# EAGLE design xBeeController (EAGLE 7.2.0)
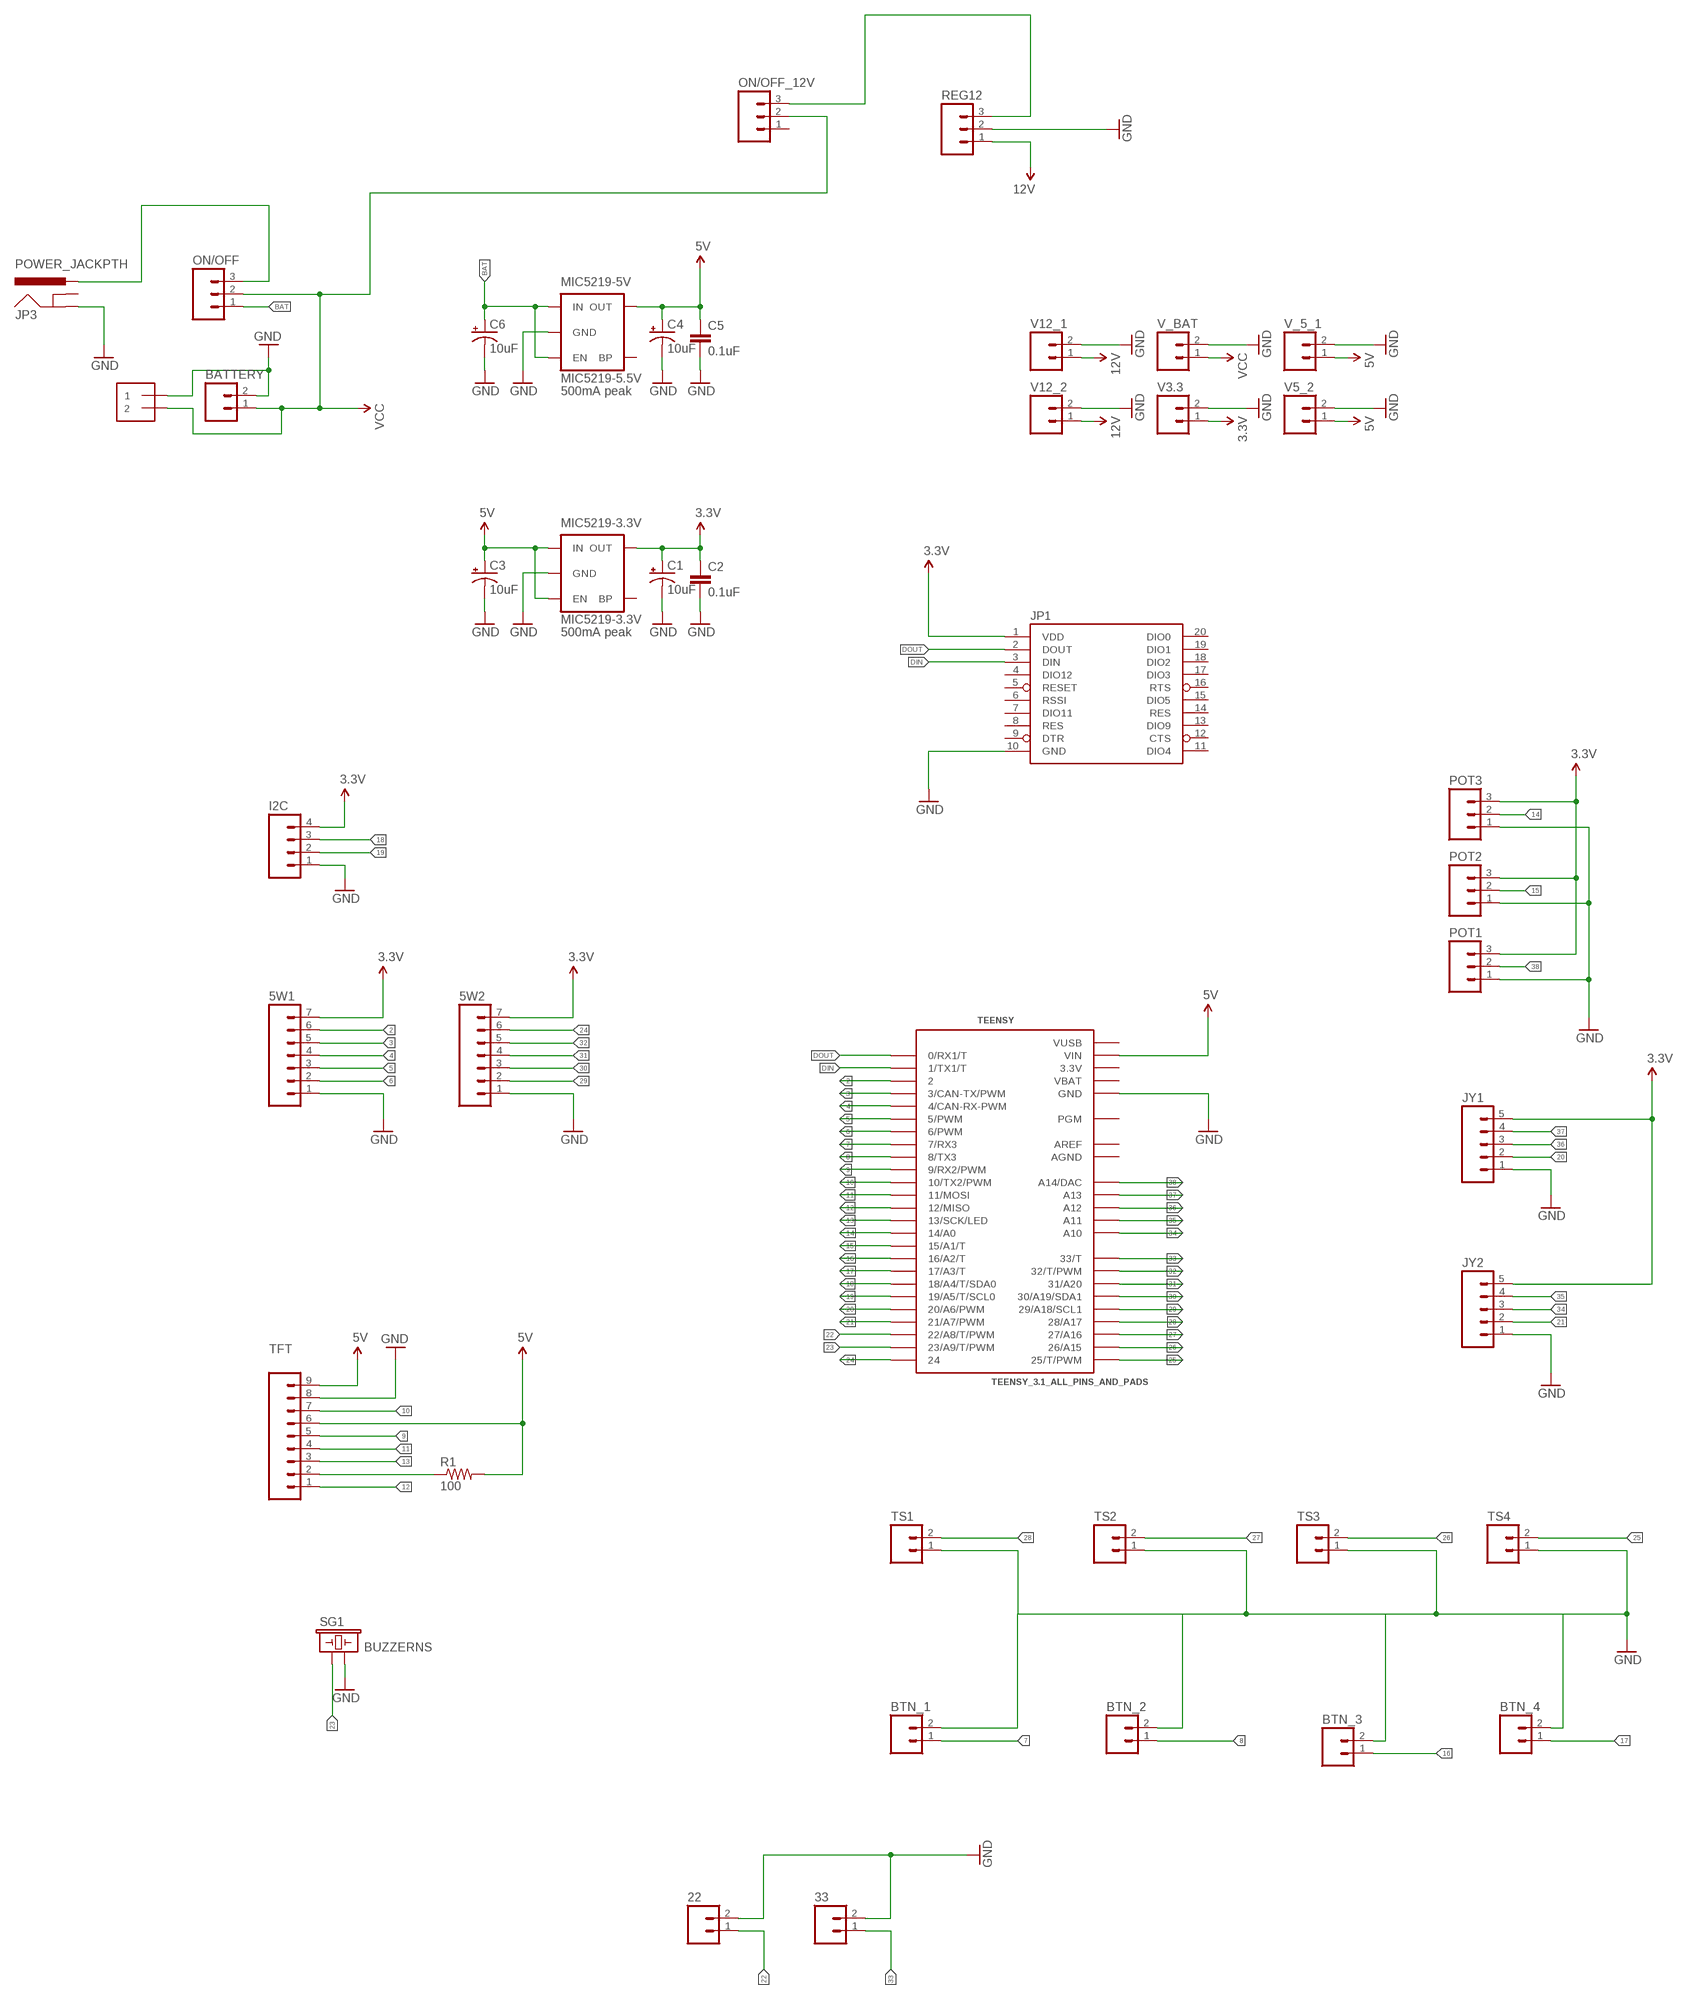
[diagram p0: schematic, sheet 1]

## Parts
5W1  M07  [1X07]
5W2  M07  [1X07]
22  M02PTH  [1X02]
33  M02PTH  [1X02]
BATTERY  M02PTH  [1X02]
BTN_1  M02PTH  [1X02]
BTN_2  M02PTH  [1X02]
BTN_3  M02PTH  [1X02]
BTN_4  M02PTH  [1X02]
C1  10uF  47UF-10V-10%(TANT)  [EIA3528]
C2  0.1uF  CAP0805  [0805]
C3  10uF  47UF-10V-10%(TANT)  [EIA3528]
C4  10uF  47UF-10V-10%(TANT)  [EIA3528]
C5  0.1uF  CAP0805  [0805]
C6  10uF  47UF-10V-10%(TANT)  [EIA3528]
I2C  M04PTH  [1X04]
J1  TERMBLOCK_1X2-3.5MM  [1X2-3.5MM]
JP1  XBEE-1B1  [XBEE-1]
JP3  POWER_JACKPTH  [POWER_JACK_PTH]
JY1  M05PTH  [1X05]
JY2  M05PTH  [1X05]
MIC5219-3.3V  V_REG_LDOSMD  [SOT23-5]
MIC5219-5V  V_REG_LDOSMD  [SOT23-5]
ON/OFF  M03PTH  [1X03]
ON/OFF_12V  M03PTH  [1X03]
POT1  M03PTH  [1X03]
POT2  M03PTH  [1X03]
POT3  M03PTH  [1X03]
R1  100  RESISTOR0805-RES  [0805]
REG12  M03PTH  [1X03]
SG1  BUZZERNS  [BUZZER-12MM-NS]
TEENSY  TEENSY_3.1_ALL_PINS_AND_PADS  [TEENSY_3.1_ALLPINS]
TFT  M09  [1X09]
TS1  M02PTH  [1X02]
TS2  M02PTH  [1X02]
TS3  M02PTH  [1X02]
TS4  M02PTH  [1X02]
V3.3  M02PTH  [1X02]
V5_2  M02PTH  [1X02]
V12_1  M02PTH  [1X02]
V12_2  M02PTH  [1X02]
V_5_1  M02PTH  [1X02]
V_BAT  M02PTH  [1X02]

## Nets
2: 5W1.6 TEENSY.2
3: 5W1.5 TEENSY.3(3/CAN-TX/PWM)
3.3V [vcc]: 5W1.7 5W2.7 C1.A(+) C2.1 I2C.4 JP1.1(VDD) JY1.5 JY2.5 MIC5219-3.3V.5(OUT) POT1.3 POT2.3 POT3.3 V3.3.1
4: 5W1.4 TEENSY.4(4/CAN-RX-PWM)
5: 5W1.3 TEENSY.5(5/PWM)
5V [vcc]: C3.A(+) C4.A(+) C5.1 MIC5219-3.3V.1(IN) MIC5219-3.3V.3(EN) MIC5219-5V.5(OUT) R1.2 TEENSY.VIN TFT.6 TFT.9 V5_2.1 V_5_1.1
6: 5W1.2 TEENSY.6(6/PWM)
7: BTN_1.1 TEENSY.7(7/RX3)
8: BTN_2.1 TEENSY.8(8/TX3)
9: TEENSY.9(9/RX2/PWM) TFT.5
10: TEENSY.10(10/TX2/PWM) TFT.7
11: TEENSY.11(11/MOSI) TFT.4
12: TEENSY.12(12/MISO) TFT.1
12V: REG12.1 V12_1.1 V12_2.1
13: TEENSY.13(13/SCK/LED) TFT.3
14: POT3.2 TEENSY.14/A0
15: POT2.2 TEENSY.15/A1(15/A1/T)
16: BTN_3.1 TEENSY.16/A2(16/A2/T)
17: BTN_4.1 TEENSY.17/A3(17/A3/T)
18: I2C.3 TEENSY.18/A4(18/A4/T/SDA0)
19: I2C.2 TEENSY.19/A5(19/A5/T/SCL0)
20: JY1.2 TEENSY.20/A6(20/A6/PWM)
21: JY2.2 TEENSY.21/A7(21/A7/PWM)
22: 22.1 TEENSY.22/A8(22/A8/T/PWM)
23: SG1.+ TEENSY.23/A9(23/A9/T/PWM)
24: 5W2.6 TEENSY.24
25: TEENSY.25(25/T/PWM) TS4.2
26: TEENSY.26(26/A15) TS3.2
27: TEENSY.27(27/A16) TS2.2
28: TEENSY.28(28/A17) TS1.2
29: 5W2.2 TEENSY.29(29/A18/SCL1)
30: 5W2.3 TEENSY.30(30/A19/SDA1)
31: 5W2.4 TEENSY.31(31/A20)
32: 5W2.5 TEENSY.32(32/T/PWM)
33: 33.1 TEENSY.33(33/T)
34: JY2.3 TEENSY.A10
35: JY2.4 TEENSY.A11
36: JY1.3 TEENSY.A12
37: JY1.4 TEENSY.A13
38: POT1.2 TEENSY.A14(A14/DAC)
BAT: C6.A(+) MIC5219-5V.1(IN) MIC5219-5V.3(EN) ON/OFF.1
DIN: JP1.3(DIN) TEENSY.1(1/TX1/T)
DOUT: JP1.2(DOUT) TEENSY.0(0/RX1/T)
GND [vcc]: 5W1.1 5W2.1 22.2 33.2 BATTERY.2 BTN_1.2 BTN_2.2 BTN_3.2 BTN_4.2 C1.C(-) C2.2 C3.C(-) C4.C(-) C5.2 C6.C(-) I2C.1 J1.1 JP1.10(GND) JP3.GND JY1.1 JY2.1 MIC5219-3.3V.2(GND) MIC5219-5V.2(GND) POT1.1 POT2.1 POT3.1 REG12.2 SG1.- TEENSY.GND TEENSY.GND1(GND) TEENSY.GND2(GND) TFT.8 TS1.1 TS2.1 TS3.1 TS4.1 V3.3.2 V5_2.2 V12_1.2 V12_2.2 V_5_1.2 V_BAT.2
N$1: R1.1 TFT.2
N$2: JP3.PWR ON/OFF.3
N$3: ON/OFF_12V.3 REG12.3
VCC: BATTERY.1 J1.2 ON/OFF.2 ON/OFF_12V.2 V_BAT.1
Unconnected: JP1.4(DIO12) JP1.5(RESET) JP1.6(RSSI) JP1.7(DIO11) JP1.8(RES) JP1.9(DTR) JP1.11(DIO4) JP1.12(CTS) JP1.13(DIO9) JP1.14(RES) JP1.15(DIO5) JP1.16(RTS) JP1.17(DIO3) JP1.18(DIO2) JP1.19(DIO1) JP1.20(DIO0) JP3.GNDBREAK MIC5219-3.3V.4(BP) MIC5219-5V.4(BP) ON/OFF_12V.1 TEENSY.PGM

## Notes on the sheet
- MIC5219-5.5V
- 500mA peak
- MIC5219-3.3V
- 500mA peak

## Power pins joined to a net without a drawn wire
3.3V: TEENSY.3.3V TEENSY.3.3V1(3.3V) TEENSY.3.3V2(3.3V)
AGND: TEENSY.AGND
AREF: TEENSY.AREF
VBAT: TEENSY.VBAT
VUSB: TEENSY.VUSB

## Library data of the parts
5W1 5W2 = SparkFun-Connectors:M07: Header 7 Standard 7-pin 0.1" header. Use with straight break away headers (SKU : PRT-00116), right angle break away headers (PRT-00553), swiss pins (PRT-00743), machine pins (PRT-00117), and female headers (PRT-00115). NOTES ON THE VARIANTS LOCK and LOCK_LONGPADS... This footprint was designed to help hold the alignment of a through-hole component (i.e. 7-pin header) while soldering it into place. You may notice that each hole has been shifted either up or down by 0.005 of an inch from it's more standard position (which is usually a perfectly straight line). This slight alteration caused the pins (the squares in the middle) to touch the edges of the holes. Because they are alternating, it causes a "brace" to hold the header in place. 0.005 has proven to be the perfect amount of "off-center" position when using our standard breakaway headers. Although looks a little odd when you look at the bare footprint, once you have a header in there, the alteration is very hard to notice. Also, if you push a header all the way into place, it is covered up entirely on the bottom side. This idea of altering the position of holes to aid alignment will be further integrated into the Sparkfun Library for other footprints. It can help hold any component with 3 or more connection pins.
22 33 BATTERY BTN_1-BTN_4 TS1-TS4 V3.3 V5_2 V12_1 V12_2 V_5_1 V_BAT = SparkFun-Connectors:M02: Standard 2-pin 0.1" header. Use with - straight break away headers ( PRT-00116) - right angle break away headers (PRT-00553) - swiss pins (PRT-00743) - machine pins (PRT-00117) - female headers (PRT-00115) Molex polarized connector foot print use with: PRT-08233 with associated crimp pins and housings. 2.54_SCREWTERM for use with PRT-10571. 3.5mm Screw Terminal footprints for PRT-08084 5mm Screw Terminal footprints for use with PRT-08432
C1 C3 C4 C6 = SparkFun-Capacitors:47UF-10V-10%(TANT): CAP-08310 47uF Tantalum SMT 10V 10% (EIA-3528); PROD_ID: CAP-08310; VALUE: 47uF
C2 C5 = SparkFun-Passives:CAP: Capacitor Standard 0603 ceramic capacitor, and 0.1" leaded capacitor.
I2C = SparkFun-Connectors:M04: Header 4 Standard 4-pin 0.1" header. Use with straight break away headers (SKU : PRT-00116), right angle break away headers (PRT-00553), swiss pins (PRT-00743), machine pins (PRT-00117), and female headers (PRT-00115). Molex polarized connector foot print use with SKU : PRT-08231 with associated crimp pins and housings. 1MM SMD Version SKU: PRT-10208
J1 = microbuilder:TERMBLOCK_1X2: 3.5mm Terminal block http://www.ladyada.net/library/pcb/eaglelibrary.html
JP1 = SparkFun-RF:XBEE-1: Xbee module footprints
JP3 = SparkFun-Connectors:POWER_JACK: Power Jack This is the standard 5.5mm barrel jack for power. The PTH is the most common, proven, reliable, footprint. The Slot footprint only works if the mill layer is transmitted to the PCB fab house so be warned. Mating wall wart : TOL-00298 (and others); PROD_ID: CONN-08197
JY1 JY2 = SparkFun-Connectors:M05: Header 5 Standard 5-pin 0.1" header. Use with straight break away headers (SKU : PRT-00116), right angle break away headers (PRT-00553), swiss pins (PRT-00743), machine pins (PRT-00117), and female headers (PRT-00115). Molex polarized connector foot print use with SKU : PRT-08230 with associated crimp pins and housings.
MIC5219-3.3V MIC5219-5V = SparkFun:V_REG_LDO: Voltage Regulator LDO Standard 150mA LDO voltage regulator in SOT-23 layout. Micrel part MIC5205. BP (by-pass) pin is used to lower output noise with 470pF cap.
ON/OFF ON/OFF_12V POT1-POT3 REG12 = SparkFun-Connectors:M03: Header 3 Standard 3-pin 0.1" header. Use with straight break away headers (SKU : PRT-00116), right angle break away headers (PRT-00553), swiss pins (PRT-00743), machine pins (PRT-00117), and female headers (PRT-00115). Molex polarized connector foot print use with SKU : PRT-08232 with associated crimp pins and housings.
R1 = SparkFun-Resistors:RESISTOR: Resistor Basic schematic elements and footprints for 0603, 1206, and PTH resistors.
SG1 = SparkFun-Electromechanical:BUZZER: Buzzer 12mm Spark Fun Electronics SKU : Comp-Buzzer
TEENSY = Teensy_3_Series_Board_v1.0:TEENSY_3.1_ALL_PINS_AND_PADS: Footprint for Teensy 3.1 board using all pads and all through-holes. Pads need a 2x7 0.1" SMD header.
TFT = SparkFun-Connectors:M09: Header 9 Standard 9-pin 0.1" header. Use with straight break away headers (SKU : PRT-00116), right angle break away headers (PRT-00553), swiss pins (PRT-00743), machine pins (PRT-00117), and female headers (PRT-00115).

## Net classes
1 vcc: width 0.305 mm

## Board
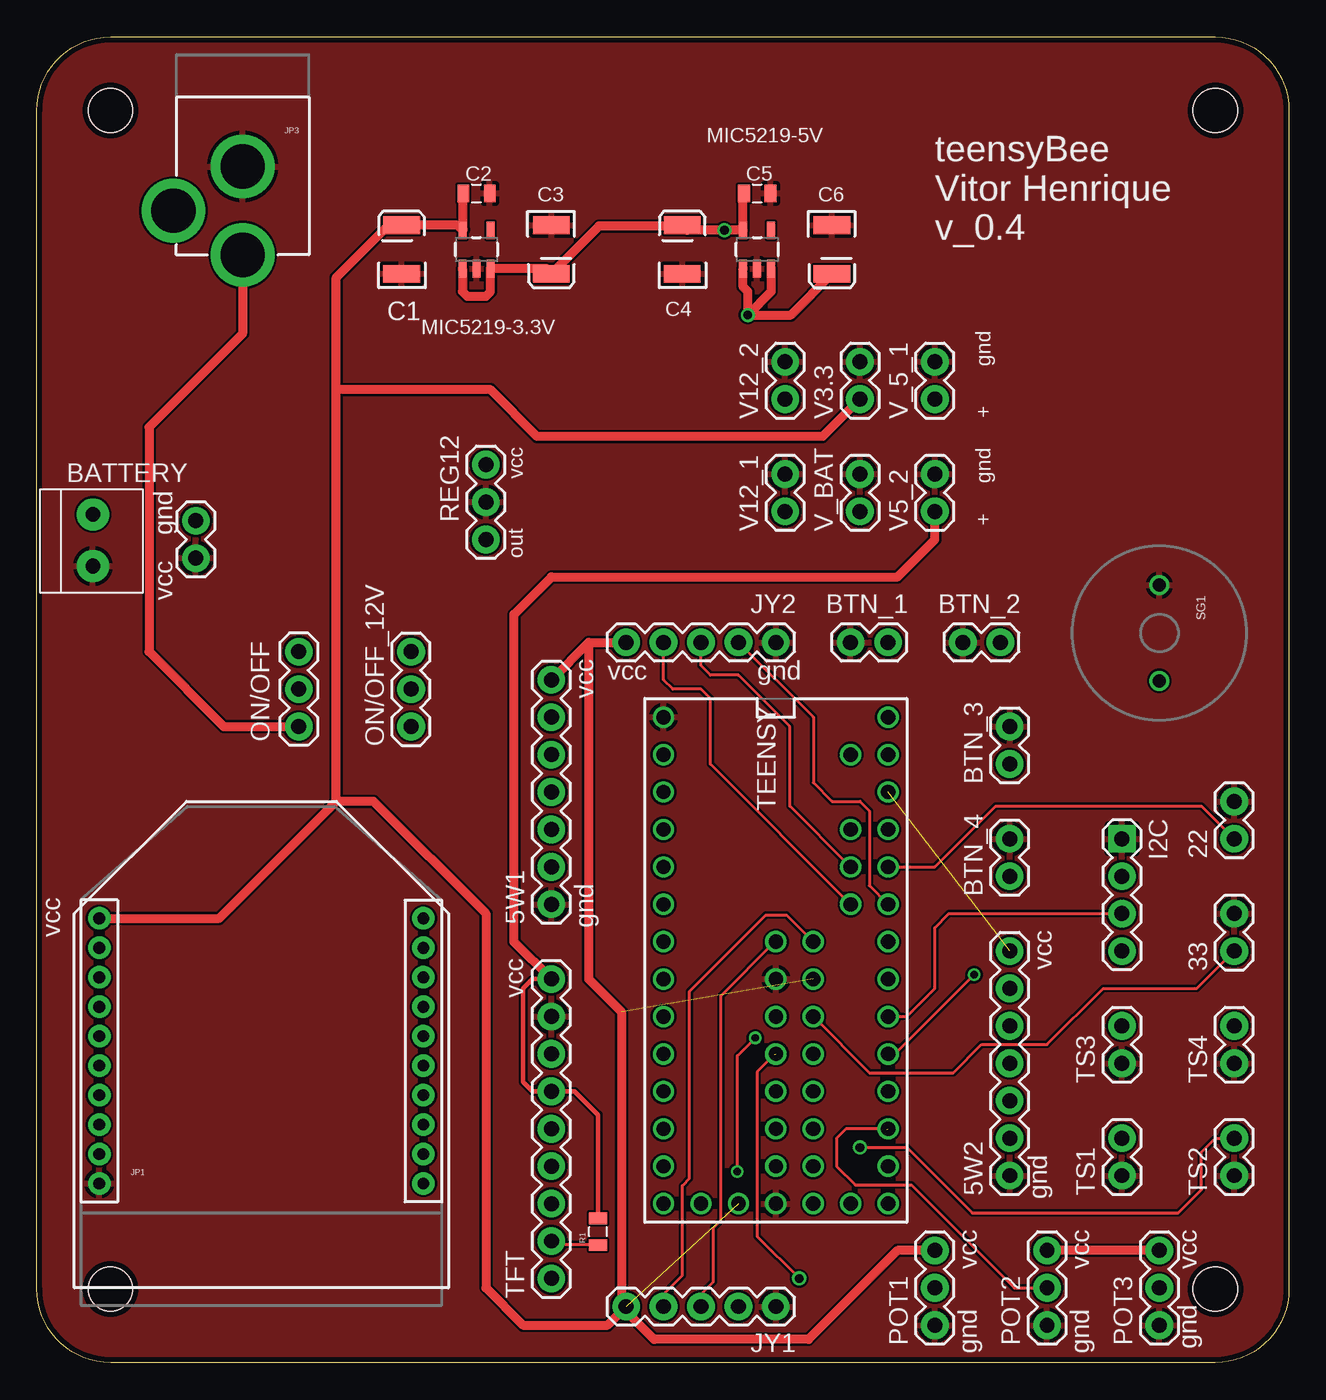
[diagram p1: board, top side]
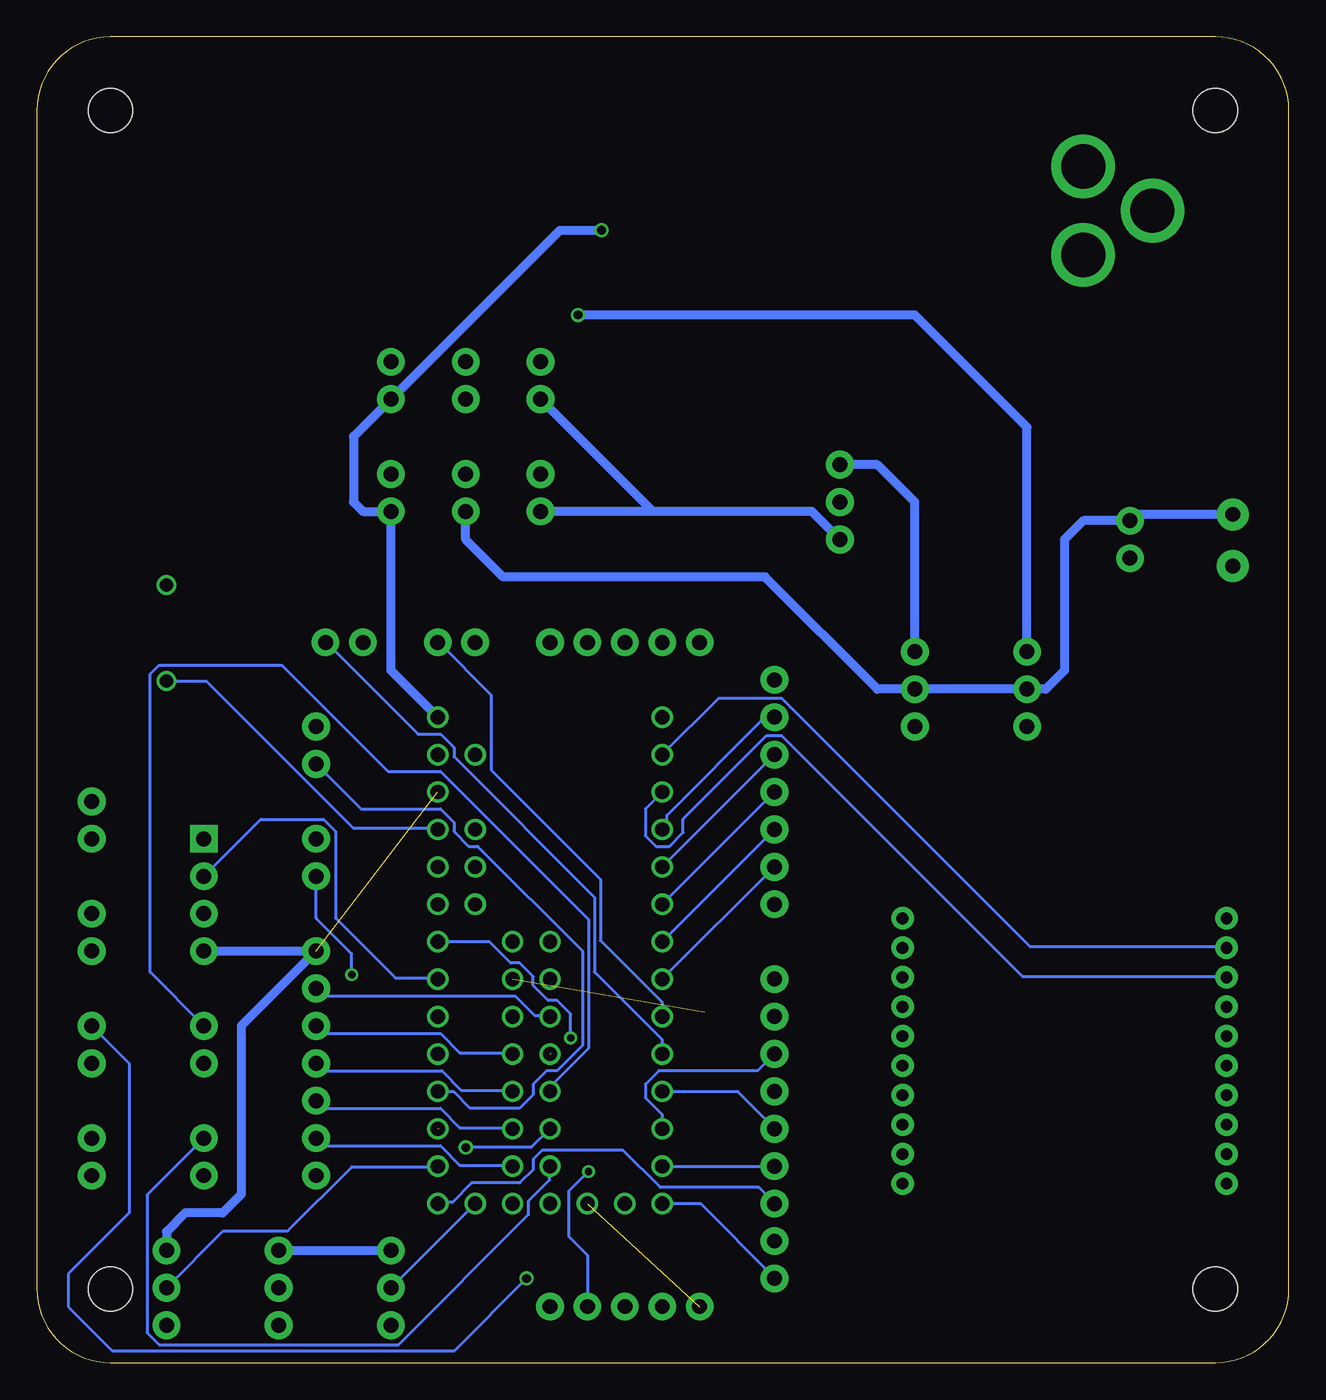
[diagram p2: board, bottom side, seen from below]

Size 85 x 90 mm. Coordinates in mm from the lower left corner, seen from the top.
Outline: 5,0 arc-90 0,5 0,85 arc-90 5,90 80,90 arc-90 85,85 85,5 arc-90 80,0 5,0
Copper layers (1*16): Top 0.0356mm / dielectric 1.5011mm / Bottom 0.0356mm
Design rules "LaenPCBOrder": minimum track width 6mil, minimum drill 13mil, track to track 6mil, track to pad 6mil, pad to pad 6mil, via to via 6mil, smd to smd 6mil, copper to edge 15mil, drill to drill 6mil, minimum pad ring 7mil, minimum via ring 7mil, stop-mask expansion 3mil, vias tented up to drill 0mil, thermal gap 10mil
Holes 3 mm at 5,5 5,85 80,85 80,5

### Footprints (pad centres in the part's own frame; a part is rotated, then mirrored left to right if it is on the bottom)
1X07 = drill 1.016 pad 1.88: 1 0,0; 2 2.54,0; 3 5.08,0; 4 7.62,0; 5 10.16,0; 6 12.7,0; 7 15.24,0
1X02 = drill 1.016 pad 1.88: 1 0,0; 2 2.54,0
EIA3528 = smd 1.2 x 2.5: A 1.65,0; C -1.65,0
0805 = smd 0.8 x 1.2: 1 -0.9,0; 2 0.9,0
1X04 = drill 1.016 pad 1.88 square: 1 0,0 | drill 1.016 pad 1.88: 2 2.54,0; 3 5.08,0; 4 7.62,0
1X2-3.5MM = drill 1 pad 2.184: 1 1.8,0; 2 -1.7,0
XBEE-1 = drill 0.8 pad 1.524: 1 -11,20; 2 -11,18; 3 -11,16; 4 -11,14; 5 -11,12; 6 -11,10; 7 -11,8; 8 -11,6; 9 -11,4; 10 -11,2; 11 11,2; 12 11,4; 13 11,6; 14 11,8; 15 11,10; 16 11,12; 17 11,14; 18 11,16; 19 11,18; 20 11,20
POWER_JACK_PTH = drill 2.997 pad 4.318: GND 0,7.7; GNDBREAK 4.7,10.7; PWR 0,13.7
1X05 = drill 1.016 pad 1.88: 1 0,0; 2 2.54,0; 3 5.08,0; 4 7.62,0; 5 10.16,0
SOT23-5 = smd 0.55 x 1.2: 1 -0.95,-1.3; 2 0,-1.3; 3 0.95,-1.3; 4 0.95,1.3; 5 -0.95,1.3
1X03 = drill 1.016 pad 1.88: 1 0,0; 2 2.54,0; 3 5.08,0
BUZZER-12MM-NS = drill 0.9: + 3.25,0; - -3.25,0
TEENSY_3.1_ALLPINS = drill 0.965: 0 -7.62,15.24; 1 -7.62,12.7; 2 -7.62,10.16; 3 -7.62,7.62; 3.3V 7.62,12.7; 3.3V1 -2.54,-15.24; 3.3V2 2.54,0; 4 -7.62,5.08; 5 -7.62,2.54; 6 -7.62,0; 7 -7.62,-2.54; 8 -7.62,-5.08; 9 -7.62,-7.62; 10 -7.62,-10.16; 11 -7.62,-12.7; 12 -7.62,-15.24; 13 7.62,-15.24; 14/A0 7.62,-12.7; 15/A1 7.62,-10.16; 16/A2 7.62,-7.62; 17/A3 7.62,-5.08; 18/A4 7.62,-2.54; 19/A5 7.62,0; 20/A6 7.62,2.54; 21/A7 7.62,5.08; 22/A8 7.62,7.62; 23/A9 7.62,10.16; 24 0,-2.54; 25 0,-5.08; 26 0,-7.62; 27 0,-10.16; 28 0,-12.7; 29 2.54,-12.7; 30 2.54,-10.16; 31 2.54,-7.62; 32 2.54,-5.08; 33 2.54,-2.54; A10 5.08,7.62; A11 5.08,5.08; A12 0,2.54; A13 2.54,2.54; A14 5.08,-15.24; AGND 7.62,15.24; AREF 5.08,10.16; GND -7.62,17.78; GND1 0,-15.24; GND2 0,0; PGM 2.54,-15.24; VBAT -5.08,-15.24; VIN 7.62,17.78; VUSB 5.08,15.24
1X09 = drill 1.016 pad 1.88: 1 0,0; 2 2.54,0; 3 5.08,0; 4 7.62,0; 5 10.16,0; 6 12.7,0; 7 15.24,0; 8 17.78,0; 9 20.32,0

### Placement (x,y rotation side)
5W1  34.92,31.11 90 top
5W2  66.04,12.7 90 top
22  81.28,35.56 90 top
33  81.28,27.94 90 top
BATTERY  10.79,57.15 270 top
BTN_1  57.78,48.9 180 top
BTN_2  65.41,48.9 180 top
BTN_3  66.04,40.64 90 top
BTN_4  66.04,33.02 90 top
C1  24.77,75.56 90 top
C2  29.84,79.38 0 top
C3  34.92,75.56 270 top
C4  43.81,75.56 90 top
C5  48.9,79.38 0 top
C6  53.98,75.56 270 top
I2C  73.66,35.56 270 top
J1  3.81,55.88 270 top
JP1  15.24,10.16 0 top
JP3  13.97,88.9 180 top
JY1  50.16,3.81 180 top
JY2  50.16,48.9 180 top
MIC5219-3.3V  29.84,75.56 0 top
MIC5219-5V  48.9,75.56 0 top
ON/OFF  17.78,48.26 270 top
ON/OFF_12V  25.4,43.18 90 top
POT1  60.96,2.54 90 top
POT2  68.58,2.54 90 top
POT3  76.2,2.54 90 top
R1  38.1,8.89 90 top
REG12  30.48,55.88 90 top
SG1  76.2,49.53 270 top
TEENSY  50.16,26.04 0 top
TFT  34.92,5.71 90 top
TS1  73.66,12.7 90 top
TS2  81.28,12.7 90 top
TS3  73.66,20.32 90 top
TS4  81.28,20.32 90 top
V3.3  55.88,65.41 90 top
V5_2  60.96,57.78 90 top
V12_1  50.8,57.78 90 top
V12_2  50.8,65.41 90 top
V_5_1  60.96,65.41 90 top
V_BAT  55.88,57.78 90 top

### Tracks (layer width: path | path; a pad name or v marks a point on that pad's centre or on a via)
2
  Bottom 0.203: TEENSY.2 42.23,36.51 42.23,37.15 35.56,43.81 5W1.6
3
  Bottom 0.203: 5W1.5 TEENSY.3
3.3V  (3 unrouted)
  Top 0.305: 28.96,76.91 MIC5219-3.3V.5 | 28.96,79.35 C2.1
  Top 0.61: 28.96,76.91 28.95,76.92 C2.1 | MIC5219-3.3V.5 28.55,77.22 C1.A 23.88,77.22 20.32,73.66 20.32,66.04 | JP1.1 12.38,30.16 20.32,38.1 | 20.32,38.1 20.32,66.04 | V3.3.1 53.34,62.87 33.97,62.87 30.8,66.04 20.32,66.04 | 20.32,38.1 22.86,38.1 30.48,30.48 30.48,5.08 33.02,2.54 38.73,2.54 JY1.5 | 5W1.7 37.47,48.9 | 37.47,48.9 JY2.5 | POT3.3 POT2.3 | POT1.3 58.42,7.62 52.39,1.59 41.91,1.59 40.01,3.49 JY1.5 | 37.47,48.9 37.47,26.04 39.69,23.81 39.69,4.13 JY1.5
  Bottom 0.61: POT2.3 POT1.3 | POT3.3 76.2,8.89 74.93,10.16 72.39,10.16 71.12,11.43 71.12,22.86 5W2.7 I2C.4
4
  Bottom 0.203: 5W1.4 TEENSY.4
5
  Bottom 0.203: 5W1.3 TEENSY.5
5V  (via drill 0.6)
  Top 0.305: TFT.9 33.66,26.04 33.02,25.4 33.02,19.05 33.66,18.41 TFT.6 36.51,18.41 38.1,16.83 R1.2
  Top 0.61: C5.1 47.95,79.33 MIC5219-5V.5 v46.67,76.86 44.16,76.86 C4.A 43.75,77.15 38.16,77.15 C3.A 34.58,74.27 MIC5219-3.3V.3 30.8,72.7 30.48,72.39 29.21,72.39 28.89,72.71 MIC5219-3.3V.1 | V5_2.1 60.96,55.88 58.42,53.34 34.92,53.34 32.38,50.8 32.38,28.57 TFT.9
  Bottom 0.61: v46.67,76.86 49.5,76.86 V_5_1.1 63.5,62.87 63.5,58.42 62.87,57.78 V5_2.1 60.96,46.99 TEENSY.VIN
6
  Bottom 0.203: 5W1.2 TEENSY.6
7
  Bottom 0.203: TEENSY.7 42.57,23.57 42.57,24.49 46.74,28.65 46.74,32.82 54.15,40.23 54.15,45.31 57.71,48.87 BTN_1.1
8
  Bottom 0.203: TEENSY.8 42.57,21.03 42.57,21.95 47.14,26.52 47.14,31.6 56.69,41.15 56.69,41.76 57.61,42.67 59.13,42.67 65.33,48.87 BTN_2.1
9
  Bottom 0.203: TEENSY.9 42.47,18.39 37.39,18.39 34.95,15.95 TFT.5
10
  Bottom 0.203: TFT.7 36.07,19.81 42.77,19.81 43.69,18.9 43.69,17.98 42.57,16.87 42.57,15.95 TEENSY.10
11
  Bottom 0.203: TEENSY.11 42.47,13.31 34.95,13.31 TFT.4
12
  Bottom 0.203: TEENSY.12 42.47,10.77 39.93,10.77 34.95,5.79 TFT.1
12V
  Bottom 0.61: 43.18,57.78 V12_1.1 | V12_2.1 43.18,57.78 | REG12.1 32.38,57.78 43.18,57.78
13
  Bottom 0.203: TEENSY.13 57.71,10.87 56.79,10.87 55.47,12.19 52.22,12.19 51.31,13.11 51.31,13.82 50.7,14.43 45.21,14.43 42.67,11.89 35.97,11.89 34.95,10.87 TFT.3
14
  Bottom 0.203: POT3.2 72.34,8.94 67.97,8.94 63.6,13.31 57.81,13.31 TEENSY.14/A0
15  (1 unrouted)
  Top 0.203: 57.71,15.85 57.68,15.88 54.93,15.88 54.29,15.24 54.29,13.34 55.56,12.06 59.37,12.06 66.36,5.08 POT2.2
16
  Bottom 0.203: BTN_3.1 62.99,37.59 57.61,37.59 56.69,36.68 56.69,36.07 55.68,35.05 55.07,35.05 47.95,27.94 47.95,21.54 49.68,19.81 50.39,19.81 51.31,18.9 51.31,18.19 52.22,17.27 55.58,17.27 56.69,18.39 57.71,18.39 TEENSY.16/A2
17  (via drill 0.51)
  Top 0.203: v63.63,26.34 58.32,21.03 57.81,21.03 TEENSY.17/A3
  Bottom 0.203: v63.63,26.34 63.63,27.75 66.04,30.16 BTN_4.1
18
  Top 0.203: TEENSY.18/A4 59.05,23.5 60.96,25.4 60.96,29.53 61.91,30.48 I2C.3
19
  Bottom 0.203: I2C.2 69.8,36.88 65.53,36.88 64.72,36.07 64.72,30.18 60.66,26.11 57.81,26.11 TEENSY.19/A5
20  (via drill 0.51)
  Top 0.203: v48.77,22.05 47.55,20.83 v47.55,12.98
  Bottom 0.203: v48.77,22.05 48.77,23.67 49.68,24.59 50.29,24.59 51.31,25.6 51.31,26.21 52.22,27.13 52.83,27.13 54.25,28.55 57.71,28.55 TEENSY.20/A6 | 47.65,3.86 JY1.2 47.62,7.3 48.9,8.57 48.9,11.63 v47.55,12.98
21
  Top 0.203: JY2.2 52.7,43.81 52.7,39.37 53.98,38.1 55.88,38.1 56.52,37.47 56.52,32.38 TEENSY.21/A7
22
  Top 0.203: TEENSY.22/A8 60.96,33.66 65.09,37.78 79.06,37.78 22.1
23
  Bottom 0.203: SG1.+ 76.2,46.23 73.46,46.23 63.5,36.27 57.81,36.27 TEENSY.23/A9
24
  Bottom 0.203: 5W2.6 65.53,24.89 52.53,24.89 51.21,23.57 50.19,23.57 TEENSY.24
25  (via drill 0.6)  (1 unrouted)
  Top 0.203: 50.09,20.93 48.9,19.74 48.9,8.57 v51.75,5.71
  Bottom 0.203: v51.75,5.71 56.66,0.81 79.87,0.81 82.87,3.81 82.87,6.03 78.74,10.16 78.74,20.32 TS4.2
26
  Bottom 0.203: TS3.2 77.32,26.52 77.32,46.74 76.71,47.35 68.38,47.35 61.16,40.13 57.61,40.13 47.55,30.07 47.55,21.34 50.09,18.8 50.09,18.49 TEENSY.26
27  (via drill 0.6)
  Top 0.203: v55.88,14.61 59.05,14.61 63.5,10.16 77.47,10.16 79.06,11.75 79.06,14.29 80.01,15.24 TS2.2
  Bottom 0.203: TEENSY.27 51.44,14.61 v55.88,14.61
28
  Bottom 0.203: TS1.2 77.52,11.38 77.52,2.03 76.71,1.22 60.45,1.22 51.61,10.06 51.61,10.97 50.19,12.39 50.19,13.31 TEENSY.28
29
  Bottom 0.203: 5W2.2 65.53,14.73 57.61,14.73 56.29,13.41 52.73,13.41 TEENSY.29
30
  Bottom 0.203: 5W2.3 65.53,17.27 57.61,17.27 56.29,15.95 52.73,15.95 TEENSY.30
31
  Bottom 0.203: 5W2.4 65.53,19.81 57.51,19.81 56.19,18.49 52.73,18.49 TEENSY.31
32
  Bottom 0.203: 5W2.5 65.53,22.35 57.61,22.35 56.29,21.03 52.73,21.03 TEENSY.32
33
  Top 0.203: TEENSY.33 56.52,19.68 62.23,19.68 64.14,21.59 68.58,21.59 72.39,25.4 78.74,25.4 33.1
34
  Top 0.203: TEENSY.A10 51.12,37.78 51.12,43.18 47.62,46.67 45.72,46.67 45.09,47.31 JY2.3
35
  Top 0.203: TEENSY.A11 45.72,40.64 45.72,45.09 45.09,45.72 43.18,45.72 42.55,46.35 JY2.4
36
  Top 0.203: TEENSY.A12 50.09,28.55 46.43,24.89 46.43,9.65 45.92,9.14 45.92,5.49 45.11,4.67 45.11,3.86 JY1.3
37
  Top 0.203: TEENSY.A13 50.9,30.38 49.48,30.38 44.3,25.2 44.3,12.5 43.81,12.01 43.81,5.92 42.57,4.67 42.57,3.86 JY1.4
38
  Bottom 0.203: POT1.2 TEENSY.A14
BAT  (via drill 0.6)
  Top 0.61: v48.26,71.12 51.18,71.12 C6.A | v48.26,71.12 48.26,72.71 47.94,73.03 MIC5219-5V.1 | MIC5219-5V.3 49.84,72.7 v48.26,71.12
  Bottom 0.61: ON/OFF.1 17.78,63.5 25.4,71.12 v48.26,71.12
DIN
  Bottom 0.203: TEENSY.1 43.69,37.59 43.69,35.76 42.98,35.05 42.06,35.05 41.13,35.98 41.13,36.89 35.46,42.57 34.44,42.57 18.09,26.21 4.27,26.21 JP1.3
DOUT
  Bottom 0.203: TEENSY.0 38.71,45.11 34.44,45.11 17.58,28.25 4.27,28.25 JP1.2
GND
  pour Top: 0,5 0,85 arc-90 5,90 80,90 arc-90 85,85 85,5 arc-90 80,0 5,0 arc-90
N$1
  Top 0.203: R1.1 38.1,8.03 35.87,8.03 35.66,8.23 34.95,8.23 TFT.2
N$2
  Top 0.61: JP3.PWR 13.97,69.85 7.62,63.5 7.62,48.26 12.7,43.18 ON/OFF.3
N$3
  Bottom 0.61: ON/OFF_12V.3 25.4,58.42 27.94,60.96 REG12.3
VCC
  Bottom 0.61: J1.2 10.37,57.58 BATTERY.1 13.97,57.15 15.24,55.88 15.24,46.99 16.51,45.72 ON/OFF.2 ON/OFF_12V.2 27.94,45.72 35.56,53.34 53.34,53.34 55.88,55.88 V_BAT.1

### Text on the board
tNames: teensyBee / Vitor Henrique / v_0.4 | gnd | + | vcc | gnd | + | gnd | out | vcc | vcc | gnd | vcc | gnd | vcc | vcc | vcc | gnd | vcc | vcc | vcc | gnd | gnd | gnd